# Altium schematic sheet Sheet_1_2021-04-14.schdoc
size 246 x 195 mm
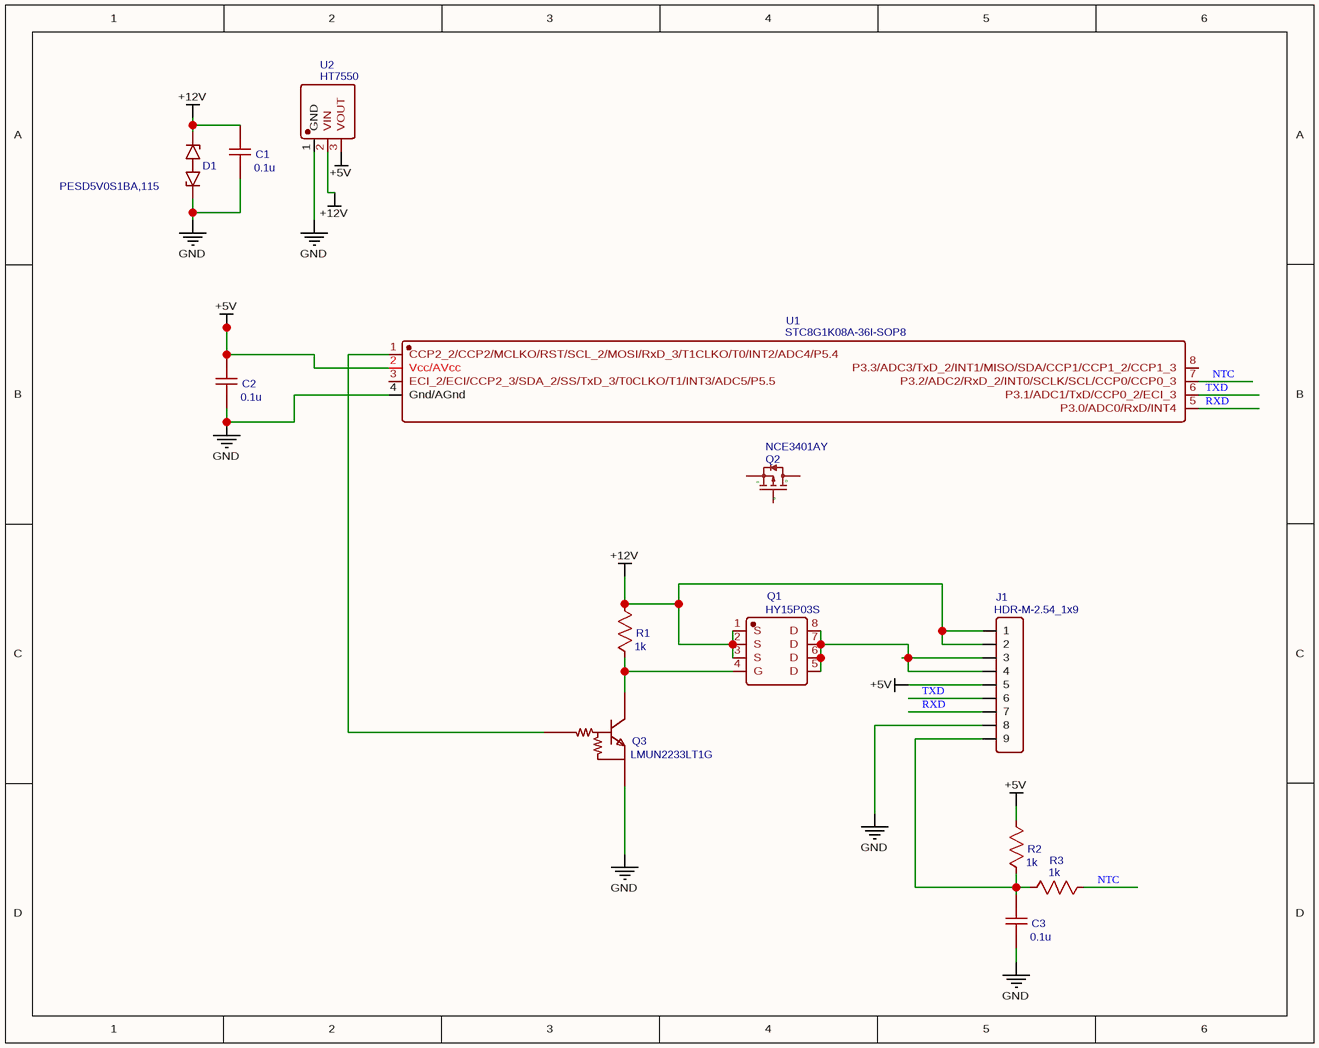
[diagram p0: Sheet_1_2021-04-14.schdoc]

## Parts
C1  0.1u  [C0603]
C2  0.1u  [C0603]
C3  0.1u  [C0603]
D1  PESD5V0S1BA,115  [SOD-323_L1.8-W1.3-LS2.5-RD]
J1  HDR-M-2.54_1x9  [HDR-M-2.54_1X9]
Q1  HY15P03S  [SOP-8_L4.9-W3.9-P1.27-LS6.0-BL]
Q2  NCE3401AY  [SOT-23_L2.9-W1.3-P1.90-LS2.4-BR]
Q3  LMUN2233LT1G  [SOT-23-3_L2.9-W1.6-P1.90-LS2.8-BR]
R1  1k  [R0603]
R2  1k  [R0603]
R3  1k  [R0603]
U1  STC8G1K08A-36I-SOP8  [SOP-8_L5.0-W4.0-P1.27-LS6.0-BL]
U2  HT7550  [SOT-89-3_L4.5-W2.5-P1.50-LS4.2-BR]

## Nets
+5V: C2.2 J1.5 R2.2 U1.2(Vcc/AVcc) U2.3(VOUT)
+12V: C1.2 D1.2 J1.1 J1.2 Q1.1(S) Q1.2(S) Q1.3(S) R1.2 U2.2(VIN)
GND: C1.1 C2.1 C3.1 D1.1 J1.8 Q3.2(E) U1.4(Gnd/AGnd) U2.1(GND)
NTC: R3.1 U1.7(P3.2/ADC2/RxD_2/INT0/SCLK/SCL/CCP0/CCP0_3)
RXD: J1.7 U1.5(P3.0/ADC0/RxD/INT4)
TXD: J1.6 U1.6(P3.1/ADC1/TxD/CCP0_2/ECI_3)
NetC3_2: C3.2 J1.9 R2.1 R3.2
NetJ1_3: J1.3 J1.4 Q1.5(D) Q1.6(D) Q1.7(D) Q1.8(D)
NetQ1_4: Q1.4(G) Q3.3(C) R1.1
NetQ3_1: Q3.1(B) U1.1(CCP2_2/CCP2/MCLKO/RST/SCL_2/MOSI/RxD_3/T1CLKO/T0/INT2/ADC4/P5.4)

Not connected (* = marked no-connect by the designer): Q2 1(G) 2(S) 3(D); U1 3(ECI_2/ECI/CCP2_3/SDA_2/SS/TxD_3/T0CLKO/T1/INT3/ADC5/P5.5) 8(P3.3/ADC3/TxD_2/INT1/MISO/SDA/CCP1/CCP1_2/CCP1_3)

## Library data of the parts
C1-C3 = 0.1u: nameAlias: Value(F); Contributor: LCEDA_Lib; spicePre: C; spiceSymbolName: C_0603_US
D1 = PESD5V0S1BA,115: BOM_Manufacturer: Nexperia; SMT Type: Extend; BOM_Supplier: LCSC; BOM_Manufacturer Part: PESD5V0S1BA,115; image: //image.lceda.cn/szlcsc/C19224.jpg; BOM_Supplier Part: C19224; BOM_JLCPCB SMD: Yes; spicePre: D; spiceSymbolName: PESD5V0S1BA,115
J1 = HDR-M-2.54_1x9: Contributor: LCEDA_Lib; BOM_Supplier Part: C225484; BOM_Supplier: LCSC; spicePre: J; spiceSymbolName: HDR-M-2.54_1x9
Q1 = HY15P03S: BOM_Manufacturer: HOOYI; SMT Type: Extend; BOM_Supplier: LCSC; BOM_Manufacturer Part: HY15P03S; BOM_Supplier Part: C122494; BOM_JLCPCB SMD: Yes; spicePre: Q; spiceSymbolName: HY15P03S
Q2 = NCE3401AY: BOM_Manufacturer: Ncepower; Contributor: LCSC; BOM_Paste Type: expand; BOM_Assembly Type: smtWeld; BOM_Supplier: LCSC; BOM_Manufacturer Part: NCE3401AY; BOM_Supplier Part: C169815; spicePre: Q; spiceSymbolName: NCE3401AY
Q3 = LMUN2233LT1G: BOM_Manufacturer: LRC; SMT Type: Extend; BOM_Supplier: LCSC; BOM_Manufacturer Part: LMUN2233LT1G; BOM_Supplier Part: C12777; BOM_JLCPCB SMD: Yes; spicePre: Q; spiceSymbolName: LMUN2233LT1G
R1-R3 = 1k: nameAlias: Value(Ω); Contributor: LCEDA_Lib; spicePre: R; spiceSymbolName: R_0603_US
U1 = STC8G1K08A-36I-SOP8: BOM_Manufacturer: STC Micro; Contributor: LCSC; BOM_Supplier: LCSC; BOM_Supplier Part: C915663; BOM_Manufacturer Part: STC8G1K08A-36I-SOP8; spicePre: U; spiceSymbolName: STC8G1K08A-36I-SOP8
U2 = HT7550: BOM_Manufacturer: KEXIN; Contributor: LCSC; BOM_Supplier: LCSC; BOM_Supplier Part: C499635; BOM_Manufacturer Part: HT7550; spicePre: U; spiceSymbolName: HT7550